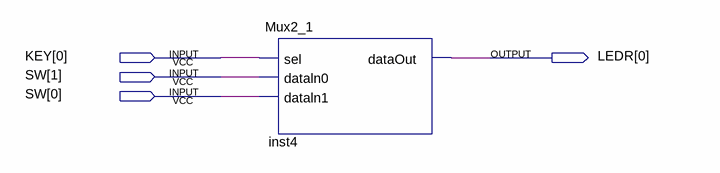
[diagram p0: schematic sheet]
// Quartus schematic Mux2_1Demo.bdf as structural Verilog: 1 symbols, 4 pins
module Mux2_1Demo (
  input  [0:0] KEY,
  input  [1:0] SW,
  output [0:0] LEDR
);

  Mux2_1 inst4 (.sel(KEY[0]), .dataln0(SW[1]), .dataln1(SW[0]), .dataOut(LEDR[0]));
endmodule
